# Altium schematic sheet Title.SchDoc: CRH - Motionboard
size A3; ApprovedBy: Yves Chevallier; CheckedBy: Yves Chevallier; Author: Yves Chevallier; CompanyName: HEIG-VD; DrawnBy: Yves Chevallier; Engineer: Yves Chevallier; Organization: HEIG-VD; Address1: HEIG-VD; Address2: CH-1401 Yverdon-les-Bains; Address3: +41 21 557 73 77; Address4: +41 21 557 63 20; DocumentNumber: ABC.00.0000.000.0; Revision: v2.0; SheetTotal: 0; DrawnByDate: 2008-01-01; ExecutionWarrantDate: 2000-01-01; ExecutionWarrant: Yves Chevallier; Context: Robotique; PageSetup: Record=PageOptions|CenterHorizontal=True|CenterVertical=False|PrintScale=0.97|XCorrection=1.00|YCorrection=1.00|PrintKind=0|BorderSize=5000000|LeftOffset=0|BottomOffset=0|Orientation=2|PaperLength=1000|PaperWidth=1000|Scale=100|PaperSource=262|PrintQuality=600|MediaType=1|DitherType=10|PaperKind=A4|PrintScaleMode=1; EngineerDate: 2008-01-01; CheckedByDate: 2008-01-01; NoProject: 12; ProjectTitle: MotionBoard; SVN: Git; Version: 2.0.0; ProjectName: PRJ
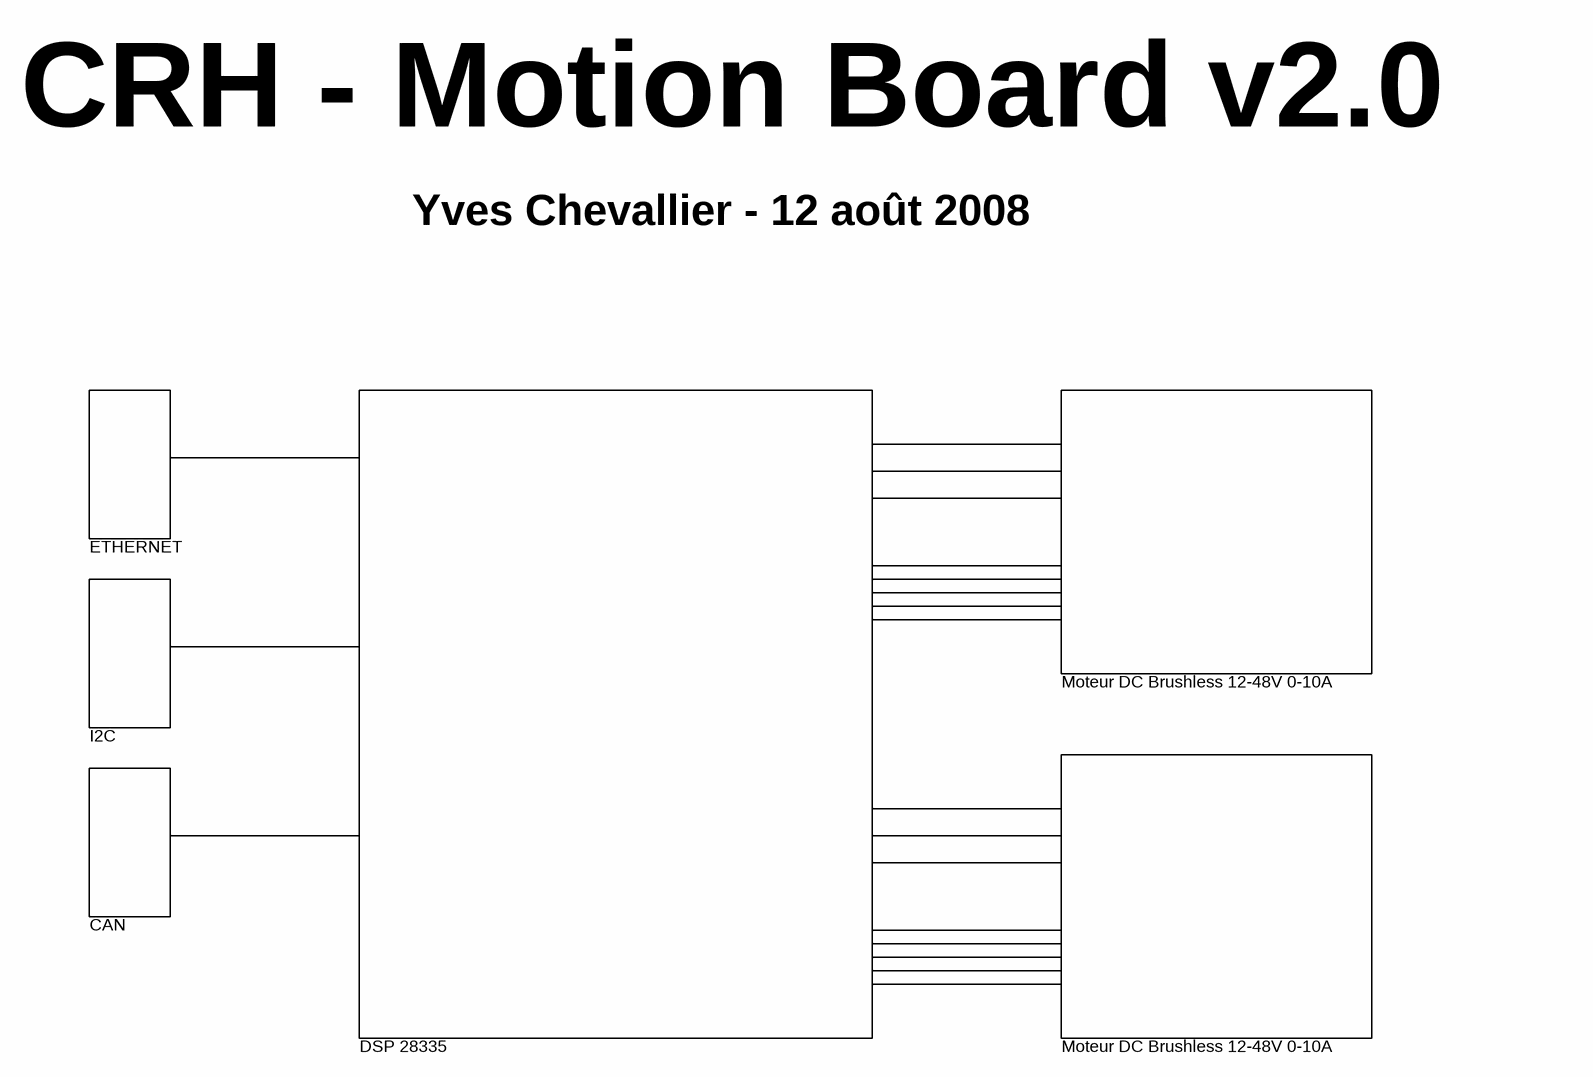
[diagram p0: Title.SchDoc]

## Notes on the sheet
- CRH - Motion Board v2.0
- Yves Chevallier - 12 août 2008
- ETHERNET
- Moteur DC Brushless 12-48V 0-10A
- I2C
- CAN
- DSP 28335
- HES-SO / HEIG-VD / TIN / IAI
  Route de Cheseaux, 1
  CH-1401 Yverdon-les-Bains
  T +41 24 557 73 77    F +41 24 557 63 20
  http://iai.heig-vd.ch
  iai@heig-vd.ch
- Title
- Size
- Date
- A4
- Project
- Sheet
- of
- No.
- Author
- SVN/Git
- Version
- File